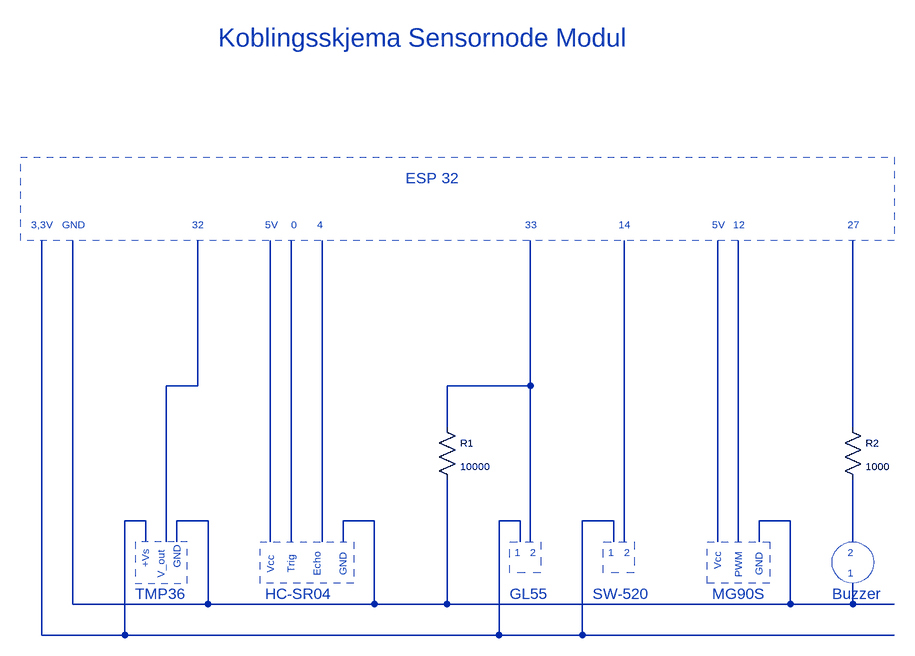
[diagram p0: schematic Koblingsskjema POLOLU 19.asc]
Koblingsskjema POLOLU 19.asc, the LTspice schematic file:
Version 4
SHEET 1 880 680
WIRE -976 -448 -976 -672
WIRE -976 -448 -1024 -448
WIRE -464 -448 -464 -672
WIRE -464 -448 -592 -448
WIRE -592 -384 -592 -448
WIRE 32 -384 32 -672
WIRE -1056 -240 -1088 -240
WIRE -960 -240 -1008 -240
WIRE -704 -240 -752 -240
WIRE -480 -240 -512 -240
WIRE -336 -240 -384 -240
WIRE -64 -240 -112 -240
WIRE -1056 -208 -1056 -240
WIRE -1024 -208 -1024 -448
WIRE -1008 -208 -1008 -240
WIRE -864 -208 -864 -672
WIRE -832 -208 -832 -672
WIRE -784 -208 -784 -672
WIRE -752 -208 -752 -240
WIRE -480 -208 -480 -240
WIRE -464 -208 -464 -448
WIRE -336 -208 -336 -240
WIRE -320 -208 -320 -672
WIRE -176 -208 -176 -672
WIRE -144 -208 -144 -672
WIRE -112 -208 -112 -240
WIRE 32 -208 32 -304
WIRE -1168 -112 -1168 -672
WIRE -960 -112 -960 -240
WIRE -960 -112 -1168 -112
WIRE -704 -112 -704 -240
WIRE -704 -112 -960 -112
WIRE -592 -112 -592 -304
WIRE -592 -112 -704 -112
WIRE -64 -112 -64 -240
WIRE -64 -112 -592 -112
WIRE 32 -112 32 -144
WIRE 32 -112 -64 -112
WIRE 96 -112 32 -112
WIRE -1216 -64 -1216 -672
WIRE -1088 -64 -1088 -240
WIRE -1088 -64 -1216 -64
WIRE -512 -64 -512 -240
WIRE -512 -64 -1088 -64
WIRE -384 -64 -384 -240
WIRE -384 -64 -512 -64
WIRE 96 -64 -384 -64
SYMBOL res -608 -400 R0
WINDOW 0 36 40 Left 1
WINDOW 3 36 76 Left 1
SYMATTR InstName R1
SYMATTR Value 10000
SYMATTR SpiceLine tol=1 pwr=0.1
SYMBOL res 16 -400 R0
WINDOW 0 36 40 Left 1
WINDOW 3 36 76 Left 1
SYMATTR InstName R2
SYMATTR Value 1000
TEXT -656 -768 Left 2 ;ESP 32
TEXT -1232 -696 Left 1 ;3,3V
TEXT -984 -696 Left 1 ;32
TEXT -472 -696 Left 1 ;33
TEXT -328 -696 Left 1 ;14
TEXT -792 -696 Left 1 ;4
TEXT 24 -696 Left 1 ;27
TEXT -152 -696 Left 1 ;12
TEXT -1184 -696 Left 1 ;GND
TEXT -1056 -168 VLeft 1 ;+Vs
TEXT -1032 -152 VLeft 1 ;V_out
TEXT -1008 -168 VLeft 1 ;GND
TEXT -864 -160 VLeft 1 ;Vcc
TEXT -832 -160 VLeft 1 ;Trig
TEXT -792 -192 VRight 1 ;Echo
TEXT -752 -192 VRight 1 ;GND
TEXT -872 -696 Left 1 ;5V
TEXT -832 -696 Left 1 ;0
TEXT -1072 -128 Left 2 ;TMP36
TEXT -872 -128 Left 2 ;HC-SR04
TEXT -496 -128 Left 2 ;GL55
TEXT -488 -192 Left 1 ;1
TEXT -464 -192 Left 1 ;2
TEXT -344 -192 Left 1 ;1
TEXT -320 -192 Left 1 ;2
TEXT -368 -128 Left 2 ;SW-520
TEXT -176 -192 VRight 1 ;Vcc
TEXT -144 -192 VRight 1 ;PWM
TEXT -112 -192 VRight 1 ;GND
TEXT -184 -696 Left 1 ;5V
TEXT -184 -128 Left 2 ;MG90S
TEXT 24 -160 Left 1 ;1
TEXT 24 -192 Left 1 ;2
TEXT -944 -984 Left 4 ;Koblingsskjema Sensornode Modul
TEXT 0 -128 Left 2 ;Buzzer
RECTANGLE Normal 96 -672 -1248 -800 2
RECTANGLE Normal -992 -208 -1072 -144 2
RECTANGLE Normal -736 -144 -880 -208 2
RECTANGLE Normal -448 -160 -496 -208 2
RECTANGLE Normal -304 -160 -352 -208 2
RECTANGLE Normal -96 -144 -192 -208 2
CIRCLE Normal 64 -144 0 -208 2

The netlist it stands for:
* Koblingsskjema POLOLU 19.asc
R1 N002 N005 10000 tol=1 pwr=0.1
R2 N003 N012 1000
* ESP 32
* 3,3V
* 32
* 33
* 14
* 4
* 27
* 12
* GND
* +Vs
* V_out
* GND
* Vcc
* Trig
* Echo
* GND
* 5V
* 0
* TMP36
* HC-SR04
* GL55
* 1
* 2
* 1
* 2
* SW-520
* Vcc
* PWM
* GND
* 5V
* MG90S
* 1
* 2
* Koblingsskjema Sensornode Modul
* Buzzer
.backanno
.end